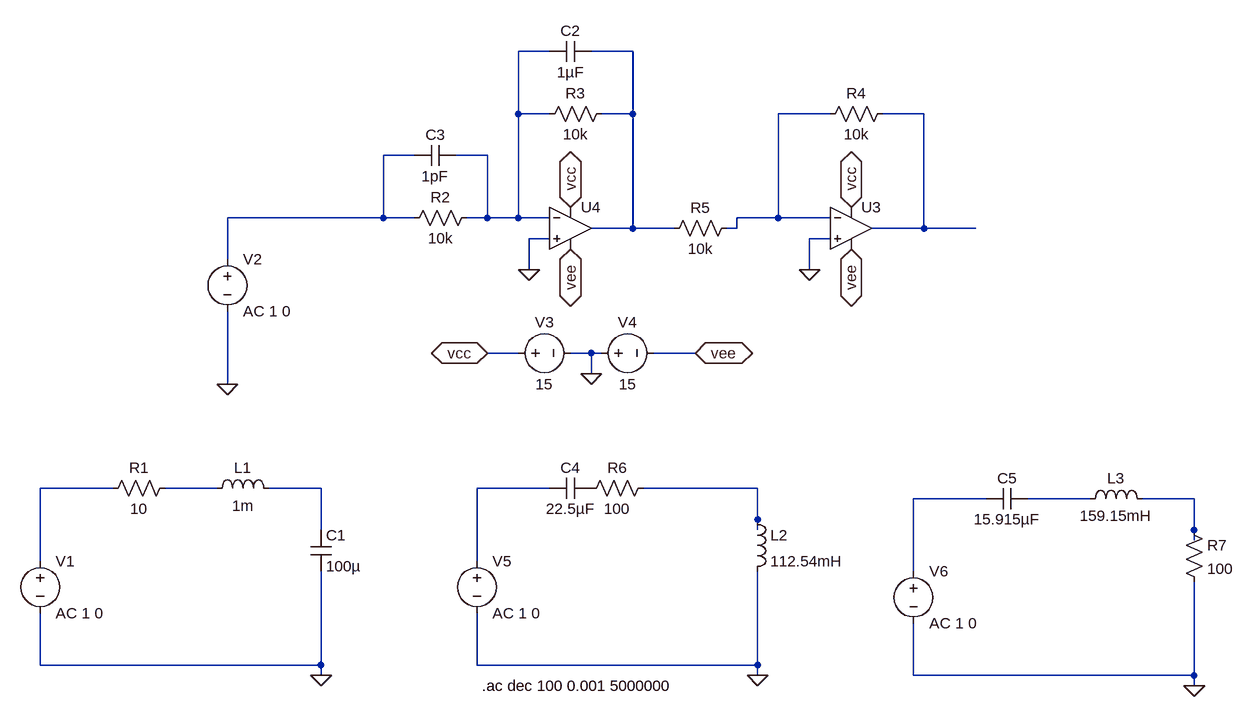
[diagram p0: schematic Taller9.asc]
Taller9.asc, the LTspice schematic file:
Version 4
SHEET 1 3960 1700
WIRE 1312 -32 1264 -32
WIRE 1440 -32 1376 -32
WIRE 1264 64 1264 -32
WIRE 1312 64 1264 64
WIRE 1440 64 1440 -32
WIRE 1440 64 1392 64
WIRE 1744 64 1664 64
WIRE 1888 64 1824 64
WIRE 1104 128 1056 128
WIRE 1216 128 1168 128
WIRE 1056 224 1056 128
WIRE 1056 224 816 224
WIRE 1104 224 1056 224
WIRE 1216 224 1216 128
WIRE 1216 224 1184 224
WIRE 1264 224 1264 64
WIRE 1264 224 1216 224
WIRE 1312 224 1264 224
WIRE 1664 224 1664 64
WIRE 1664 224 1600 224
WIRE 1744 224 1664 224
WIRE 1440 240 1440 64
WIRE 1440 240 1376 240
WIRE 1504 240 1440 240
WIRE 1600 240 1600 224
WIRE 1600 240 1584 240
WIRE 1888 240 1888 64
WIRE 1888 240 1808 240
WIRE 1968 240 1888 240
WIRE 1312 256 1280 256
WIRE 1744 256 1712 256
WIRE 816 288 816 224
WIRE 1280 304 1280 256
WIRE 1712 304 1712 256
WIRE 1264 432 1216 432
WIRE 1376 432 1344 432
WIRE 1392 432 1376 432
WIRE 1536 432 1472 432
WIRE 1376 464 1376 432
WIRE 816 480 816 368
WIRE 640 640 528 640
WIRE 800 640 720 640
WIRE 960 640 880 640
WIRE 1312 640 1200 640
WIRE 1632 640 1456 640
WIRE 1984 656 1872 656
WIRE 2144 656 2048 656
WIRE 2304 656 2224 656
WIRE 1632 688 1632 640
WIRE 960 704 960 640
WIRE 1632 704 1632 688
WIRE 2304 704 2304 656
WIRE 2304 720 2304 704
WIRE 528 752 528 640
WIRE 1200 752 1200 640
WIRE 1872 768 1872 656
WIRE 528 912 528 832
WIRE 960 912 960 768
WIRE 960 912 528 912
WIRE 1200 912 1200 832
WIRE 1632 912 1632 768
WIRE 1632 912 1200 912
WIRE 960 928 960 912
WIRE 1632 928 1632 912
WIRE 1872 928 1872 848
WIRE 2304 928 2304 784
WIRE 2304 928 1872 928
WIRE 2304 944 2304 928
FLAG 960 928 0
FLAG 816 480 0
FLAG 1280 304 0
FLAG 1712 304 0
FLAG 1216 432 vcc
IOPIN 1216 432 BiDir
FLAG 1536 432 vee
IOPIN 1536 432 BiDir
FLAG 1344 208 vcc
IOPIN 1344 208 BiDir
FLAG 1776 208 vcc
IOPIN 1776 208 BiDir
FLAG 1344 272 vee
IOPIN 1344 272 BiDir
FLAG 1776 272 vee
IOPIN 1776 272 BiDir
FLAG 1632 928 0
FLAG 2304 944 0
FLAG 1376 464 0
SYMBOL res 736 624 R90
WINDOW 0 0 56 VBottom 2
WINDOW 3 32 56 VTop 2
SYMATTR InstName R1
SYMATTR Value 10
SYMBOL ind 784 656 R270
WINDOW 0 32 56 VTop 2
WINDOW 3 5 56 VBottom 2
SYMATTR InstName L1
SYMATTR Value 1m
SYMBOL cap 944 704 R0
SYMATTR InstName C1
SYMATTR Value 100µ
SYMBOL voltage 528 736 R0
SYMATTR InstName V1
SYMATTR Value AC 1 0
SYMBOL voltage 816 272 R0
SYMATTR InstName V2
SYMATTR Value AC 1 0
SYMBOL res 1200 208 R90
WINDOW 0 0 56 VBottom 2
WINDOW 3 32 56 VTop 2
SYMATTR InstName R2
SYMATTR Value 10k
SYMBOL res 1408 48 R90
WINDOW 0 0 56 VBottom 2
WINDOW 3 32 56 VTop 2
SYMATTR InstName R3
SYMATTR Value 10k
SYMBOL cap 1376 -48 R90
WINDOW 0 0 32 VBottom 2
WINDOW 3 32 32 VTop 2
SYMATTR InstName C2
SYMATTR Value 1µF
SYMBOL res 1840 48 R90
WINDOW 0 0 56 VBottom 2
WINDOW 3 32 56 VTop 2
SYMATTR InstName R4
SYMATTR Value 10k
SYMBOL res 1600 224 R90
WINDOW 0 0 56 VBottom 2
WINDOW 3 32 56 VTop 2
SYMATTR InstName R5
SYMATTR Value 10k
SYMBOL voltage 1248 432 R270
WINDOW 0 32 56 VTop 2
WINDOW 3 -32 56 VBottom 2
SYMATTR InstName V3
SYMATTR Value 15
SYMBOL voltage 1376 432 R270
WINDOW 0 32 56 VTop 2
WINDOW 3 -32 56 VBottom 2
SYMATTR InstName V4
SYMATTR Value 15
SYMBOL cap 1168 112 R90
WINDOW 0 0 32 VBottom 2
WINDOW 3 32 32 VTop 2
SYMATTR InstName C3
SYMATTR Value 1pF
SYMBOL voltage 1200 736 R0
SYMATTR InstName V5
SYMATTR Value AC 1 0
SYMBOL ind 2128 672 R270
WINDOW 0 32 56 VTop 2
WINDOW 3 5 56 VBottom 2
SYMATTR InstName L3
SYMATTR Value 159.15mH
SYMBOL voltage 1872 752 R0
SYMATTR InstName V6
SYMATTR Value AC 1 0
SYMBOL cap 1376 624 R90
WINDOW 0 0 32 VBottom 2
WINDOW 3 32 32 VTop 2
SYMATTR InstName C4
SYMATTR Value 22.5µF
SYMBOL ind 1616 672 R0
SYMATTR InstName L2
SYMATTR Value 112.54mH
SYMBOL res 1472 624 R90
WINDOW 0 0 56 VBottom 2
WINDOW 3 32 56 VTop 2
SYMATTR InstName R6
SYMATTR Value 100
SYMBOL res 2288 688 R0
SYMATTR InstName R7
SYMATTR Value 100
SYMBOL cap 2048 640 R90
WINDOW 0 0 32 VBottom 2
WINDOW 3 32 32 VTop 2
SYMATTR InstName C5
SYMATTR Value 15.915µF
SYMBOL OpAmps\\UniversalOpAmp2 1776 240 R0
SYMATTR InstName U3
SYMBOL OpAmps\\UniversalOpAmp2 1344 240 R0
SYMATTR InstName U4
TEXT 1208 944 Left 2 !.ac dec 100 0.001 5000000

The netlist it stands for:
* Taller9.asc
R1 N007 N006 10
L1 N007 N008 1m
C1 N008 0 100µ
V1 N006 0 AC 1 0
V2 N005 0 AC 1 0
R2 N001 N005 10k
R3 N002 N001 10k
C2 N002 N001 1µF
R4 N004 N003 10k
R5 N003 N002 10k
V3 vcc 0 15
V4 0 vee 15
C3 N001 N005 1pF
V5 N009 0 AC 1 0
L3 N012 N013 159.15mH
V6 N011 0 AC 1 0
C4 P001 N009 22.5µF
L2 N010 0 112.54mH
R6 N010 P001 100
R7 N013 0 100
C5 N012 N011 15.915µF
XU3 0 N003 vcc vee N004 level2 Avol=1Meg GBW=10Meg Slew=10Meg Ilimit=25m Rail=0 Vos=0 En=0 Enk=0 In=0 Ink=0 Rin=500Meg  ; pins In+ In- V+ V- OUT
XU4 0 N001 vcc vee N002 level2 Avol=1Meg GBW=10Meg Slew=10Meg Ilimit=25m Rail=0 Vos=0 En=0 Enk=0 In=0 Ink=0 Rin=500Meg  ; pins In+ In- V+ V- OUT
.ac dec 100 0.001 5000000
.lib UniversalOpAmp2.lib
.backanno
.end